# Altium schematic sheet DSP_USB.SchDoc
size A4
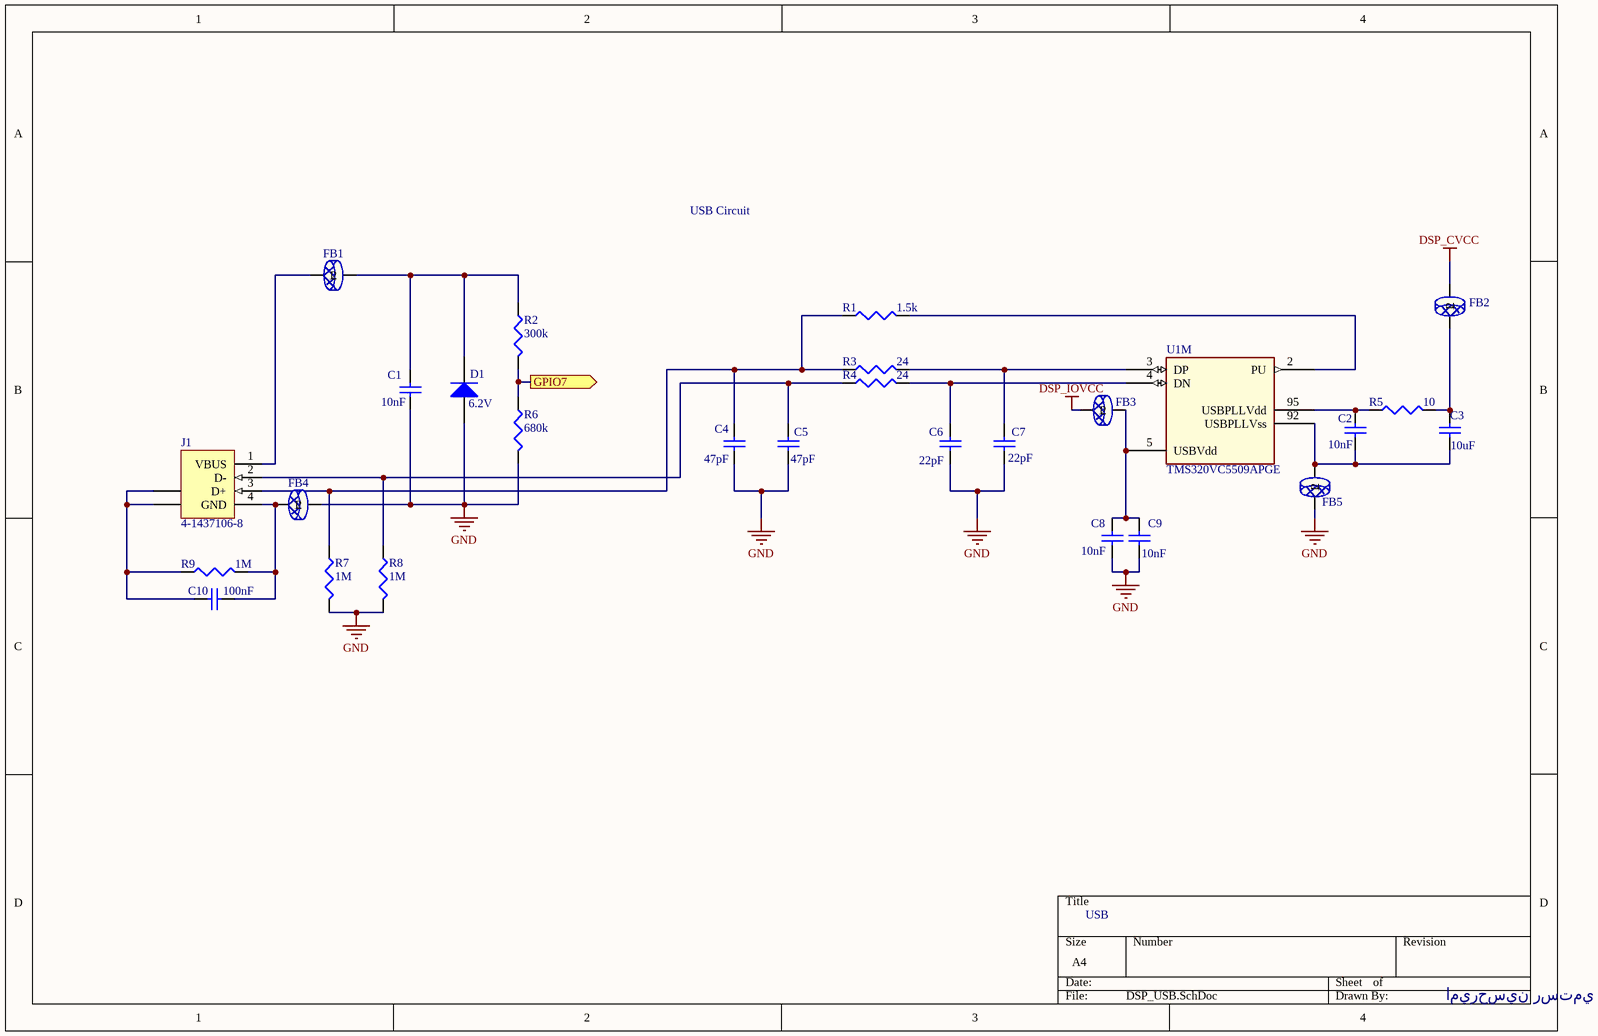
[diagram p0: DSP_USB.SchDoc]

## Parts
C1  10nF  [1608[0603]]
C2  10nF  [1608[0603]]
C3  10uF  [C1206]
C4  47pF  [1608[0603]]
C5  47pF  [1608[0603]]
C6  22pF  [1608[0603]]
C7  value 22pF  [1608[0603]]  (hidden comment: 24pF)
C8  10nF  [1608[0603]]
C9  10nF  [1608[0603]]
C10  100nF  [1608[0603]]
D1  6.2V  [MELF-D3513-1405]
FB1  50  [3216[1206]]  (value not drawn)
FB2  50  [3216[1206]]  (value not drawn)
FB3  50  [3216[1206]]  (value not drawn)
FB4  50  [3216[1206]]  (value not drawn)
FB5  50  [3216[1206]]  (value not drawn)
J1  4-1437106-8  [1437106]
R1  1.5k  [J1-0603]
R2  300k  [J1-0603]
R3  24  [J1-0603]
R4  24  [J1-0603]
R5  10  [J1-0603]
R6  680k  [J1-0603]
R7  1M  [J1-0603]
R8  1M  [J1-0603]
R9  1M  [J1-0603]
U1  TMS320VC5509APGE  [TMSVC5509APGA]  (part M of 16)

## Ports
GPIO7 (out)

## Nets
DSP_CVCC: FB2.1
DSP_IOVCC: FB3.2
GND: C1.2 C4.2 C5.2 C6.2 C7.2 C8.2 C9.2 D1.1(A) FB4.1 FB5.2 R6.2 R7.2 R8.2
GPIO7: R2.2 R6.1 ; port GPIO7
NetC1_1: C1.1 D1.2(K) FB1.1 R2.1
NetC2_1: C2.1 R5.1 U1.95(USBPLLVdd)
NetC2_2: C2.2 C3.2 FB5.1 U1.92(USBPLLVss)
NetC3_1: C3.1 FB2.2 R5.2
NetC4_1: C4.1 J1.3(D+) R1.1 R3.1 R7.1
NetC5_1: C5.1 J1.2(D-) R4.1 R8.1
NetC6_1: C6.1 R4.2 U1.4(DN)
NetC7_1: C7.1 R3.2 U1.3(DP)
NetC8_1: C8.1 C9.1 FB3.1 U1.5(USBVdd)
NetC10_1: C10.1 FB4.2 J1.4(GND) R9.2
NetC10_2: C10.2 J1.5(SHLD) J1.6(SHLD) R9.1
NetFB1_2: FB1.2 J1.1(VBUS)
NetR1_2: R1.2 U1.2(PU)

## Notes on the sheet
- USB Circuit
- USB
- اميرحسين رستمي

## Library data of the parts
C1 C3-C10 = Cap Semi: Capacitor; Published: 8-Jun-2000; LatestRevisionDate: 17-Jul-2002; LatestRevisionNote: Re-released for DXP Platform.; PackageReference: C1206; Publisher: Altium Limited
  C1 C8 C9: Value: 10nF
  C3: Value: 10uF
  C4 C5: Value: 47pF
  C6: Value: 22pF
  C10: Value: 100nF
C2 = Cap Semi: Capacitor (Semiconductor SIM Model); Published: 8-Jun-2000; LatestRevisionDate: 17-Jul-2002; LatestRevisionNote: Re-released for DXP Platform.; PackageReference: C1206; Publisher: Altium Limited; Value: 10nF
D1 = Diode: Diode zener; Published: 8-Jun-2000; LatestRevisionDate: 17-Jul-2002; LatestRevisionNote: Re-released for DXP Platform.; PackageDocument: Sep-1996; PackageReference: SMC; Publisher: Altium Limited; Code_JEDEC: DO-214-AB
FB1-FB5 = Ferrite Bead
J1 = 4-1437106-8: USB 1.1, Right Angle, Thru-Hole, B Type, Receptacle, 4 Position, Natural; ContactMaterial: Copper Alloy; ContactPlating: Gold (30); TerminationLength: 2.90mm [0.114in.]; PCB_Layout: Complies with manufacturer's recommendation.; DrillSize: Corresponds to nominal value.; PanelGround: Without; Published: 15-Jul-2004; DatasheetDocument: 05-Jan-2004; PackageDocument: 05-Jan-2004; PackageReference: 1437106; Publisher: Altium Limited; HousingMaterial: Glass-Filled Thermoplastic; ComponentLink1Description: Manufacturer Link; ComponentLink1URL: http://www.tycoelectronics.com/; ComponentLink2Description: Packaging Specification; ComponentLink2URL: http://ecommas.tycoelectronics.com/commerce/DocumentDelivery/DDEController?Action=showdoc&DocId=Customer+Drawing%7F1437106%7FC%7Ftif%7FEnglish%7FENG_CD_1437106_C.tif
R1-R9 = Res3: Resistor; Published: 8-Jun-2000; LatestRevisionDate: 04-Mar-2005; LatestRevisionNote: PCB Footprint replaced.; PackageReference: J1-0603; Publisher: Altium Limited
  R1: Value: 1.5k
  R2: Value: 300k
  R3 R4: Value: 24
  R5: Value: 10
  R6: Value: 680k
  R7-R9: Value: 1M